# EAGLE schematic all_scheme (EAGLE 9.6.2)
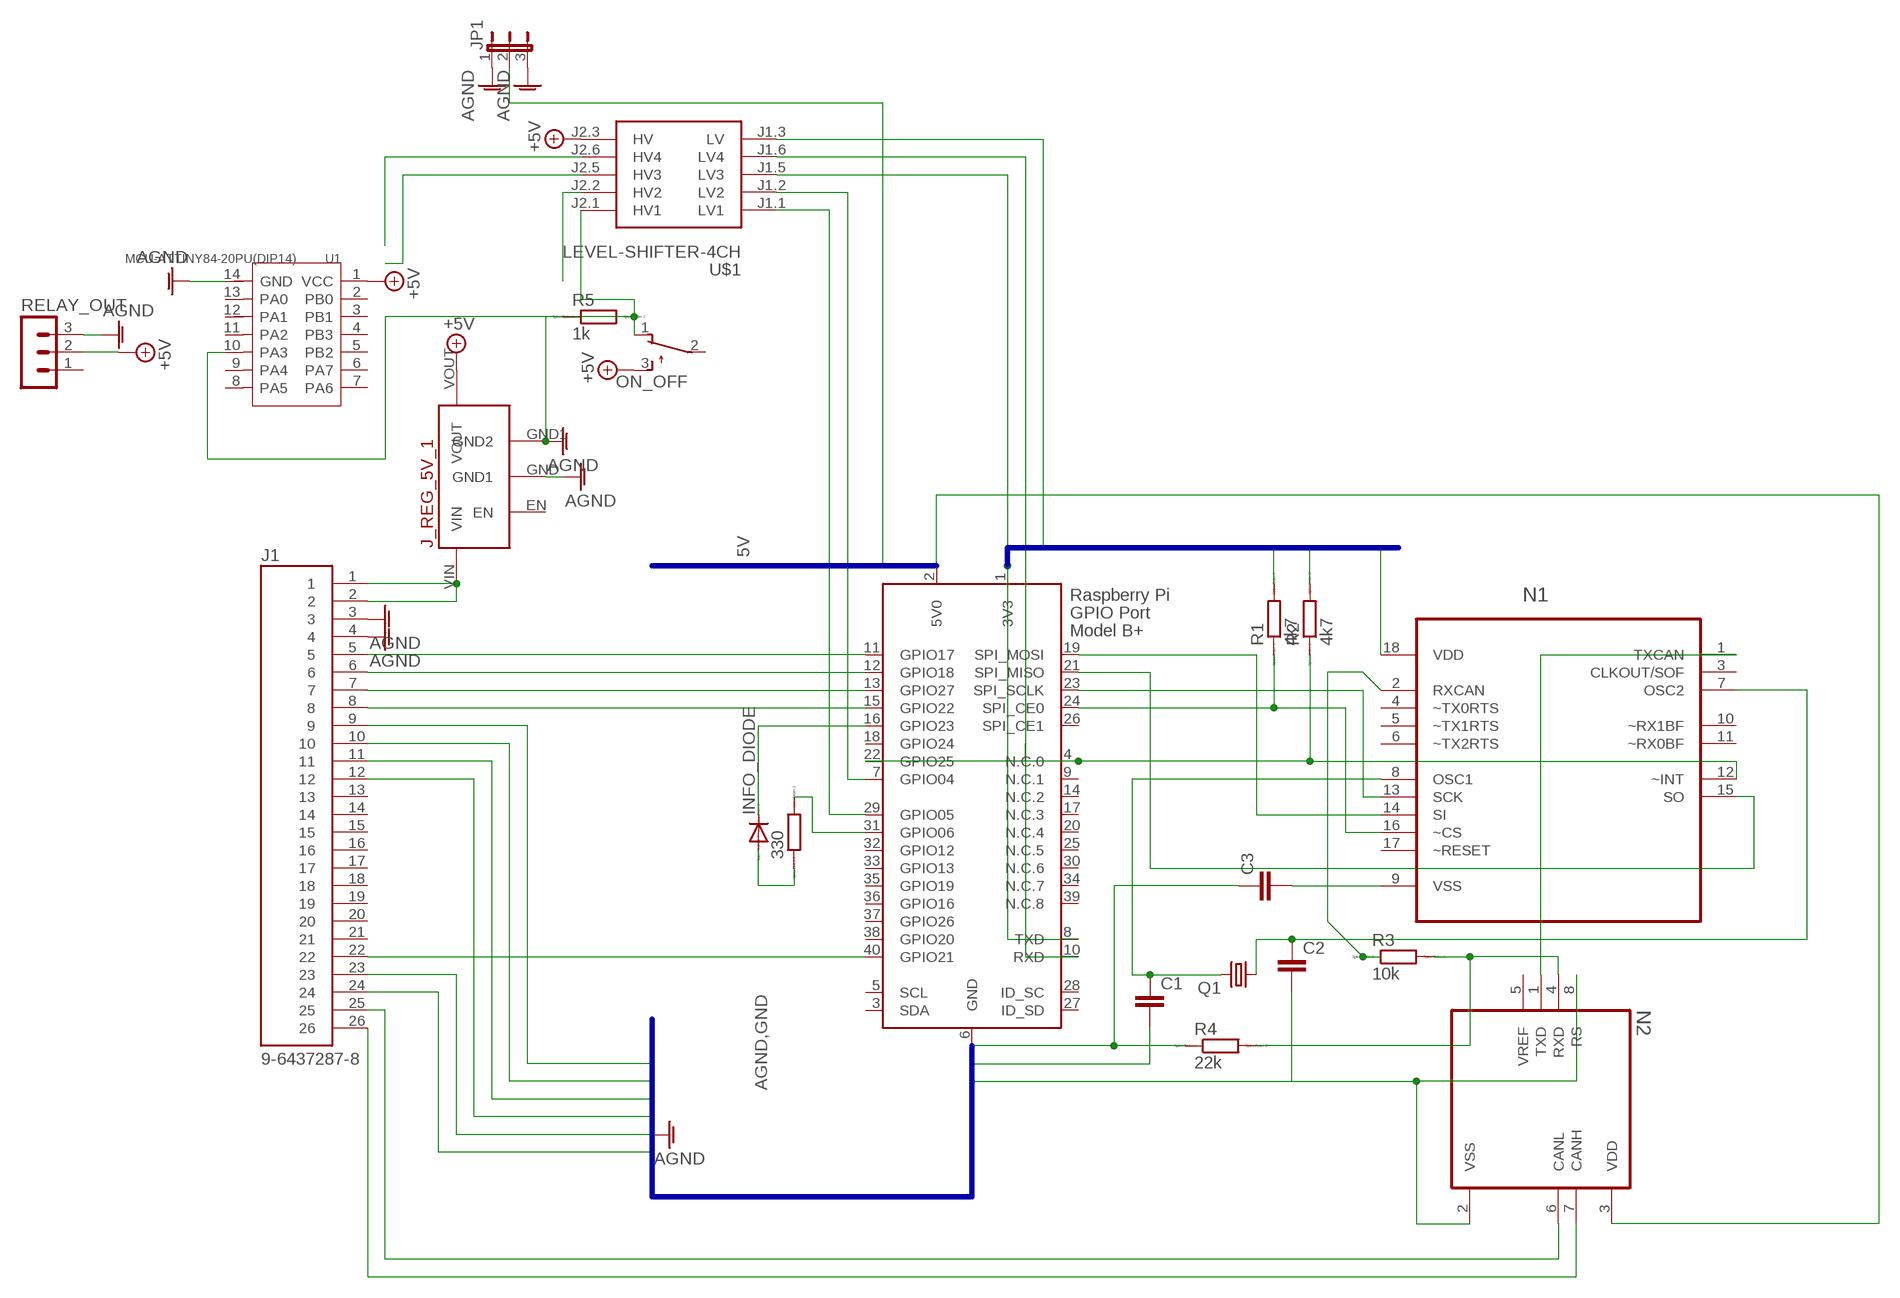
[diagram p0: schematic, sheet 1]

## Parts
330  R0207/10  [0207/10]
C1  C5/2.5  [C5B2.5]
C2  C5/2.5  [C5B2.5]
C3  C5/2.5  [C5B2.5]
INFO_DIODE  1N4004  [DO41-10]
J1  9-6437287-8  [TE_9-6437287-8]
J_REG_5V_1  5V_VOLTAGE_REGULATOR  [5V_VOLTAGE_REGULATOR]
JP1  JP2E  [JP2]
N1  MCP2515-E/P  [DIP254P762X432-18]
N2  MCP2551-E/P  [DIP787W46P254L927H533Q8]
ON_OFF  TL32PO  [TL3XPO]
Q1  CRYSTALHC49S  [HC49/S]
R1  4k7  R0207/10  [0207/10]
R2  4k7  R0207/10  [0207/10]
R3  10k  R0207/10  [0207/10]
R4  22k  R0207/10  [0207/10]
R5  1k  R0204/7  [0204/7]
RELAY_OUT  MA03-1  [MA03-1]
U1  MCU-ATTINY84-20PU(DIP14)  [DIP14-2.54-17.24X6.35MM]
U$1  LEVEL-SHIFTER-4CH  [LEVEL-SHIFTER-4CH]
X1  RASPI_GPIO_B+_PIN  [RASPI_GPIO_B+_PIN]

## Nets
4K: N1.14(SI) X1.19(SPI_MOSI)
5V: JP1.2 N2.3(VDD) X1.2(5V0)
+5V: J_REG_5V_1.VOUT ON_OFF.3(S) RELAY_OUT.2 U1.1(VCC) U$1.J2.3(HV)
AGND: J1.3 J1.4 J1.23 J_REG_5V_1.GND1(GND2) J_REG_5V_1.GND(GND1) JP1.1 JP1.3 R5.1 RELAY_OUT.3 U1.14(GND)
B$1: N1.18(VDD) R1.2 R2.2 U$1.J1.3(LV)
GND: C1.2 C2.2 C3.1 J1.9 J1.10 J1.11 J1.12 J1.24 N2.2(VSS) N2.8(RS) R4.1 X1.6(GND)
N$1: J1.26 N2.7(CANH)
N$2: J1.25 N2.6(CANL)
N$3: J1.1 J1.2 J_REG_5V_1.VIN
N$4: N1.13(SCK) X1.23(SPI_SCLK)
N$5: N2.4(RXD) R3.2 R4.2
N$6: N1.15(SO) X1.21(SPI_MISO)
N$7: N1.16(~CS) R1.1 X1.24(SPI_CE0)
N$8: N1.1(TXCAN) N2.1(TXD)
N$9: C1.1 N1.8(OSC1) Q1.2
N$10: N1.2(RXCAN) R3.1
N$11: C2.1 N1.7(OSC2) Q1.1
N$12: C3.2 N1.9(VSS)
N$13: N1.12(~INT) R2.1 X1.4(N.C.0) X1.22(GPIO25)
N$14: J1.5 X1.11(GPIO17)
N$15: J1.6 X1.12(GPIO18)
N$16: J1.7 X1.13(GPIO27)
N$17: J1.8 X1.15(GPIO22)
N$18: J1.22 X1.40(GPIO21)
N$19: 330.1 INFO_DIODE.A
N$20: 330.2 X1.31(GPIO06)
N$21: INFO_DIODE.C X1.16(GPIO23)
N$22: U$1.J2.6(HV4)
N$24: ON_OFF.1(O) R5.2 U1.10(PA3) U$1.J2.1(HV1)
N$25: U$1.J2.5(HV3)
N$26: U$1.J1.6(LV4) X1.10(RXD)
N$27: U$1.J1.5(LV3) X1.1(3V3) X1.8(TXD)
N$29: U$1.J2.2(HV2)
N$30: U$1.J1.1(LV1) X1.29(GPIO05)
N$31: U$1.J1.2(LV2) X1.7(GPIO04)
Unconnected: J1.13 J1.14 J1.15 J1.16 J1.17 J1.18 J1.19 J1.20 J1.21 J_REG_5V_1.EN N1.3(CLKOUT/SOF) N1.4(~TX0RTS) N1.5(~TX1RTS) N1.6(~TX2RTS) N1.10(~RX1BF) N1.11(~RX0BF) N1.17(~RESET) N2.5(VREF) ON_OFF.2(P) RELAY_OUT.1 U1.2(PB0) U1.3(PB1) U1.4(PB3) U1.5(PB2) U1.6(PA7) U1.7(PA6) U1.8(PA5) U1.9(PA4) U1.11(PA2) U1.12(PA1) U1.13(PA0) X1.3(SDA) X1.5(SCL) X1.9(N.C.1) X1.14(N.C.2) X1.17(N.C.3) X1.18(GPIO24) X1.20(N.C.4) X1.25(N.C.5) X1.26(SPI_CE1) X1.27(ID_SD) X1.28(ID_SC) X1.30(N.C.6) X1.32(GPIO12) X1.33(GPIO13) X1.34(N.C.7) X1.35(GPIO19) X1.36(GPIO16) X1.37(GPIO26) X1.38(GPIO20) X1.39(N.C.8)

## Buses
5V
AGND,GND
B$1

## Library data of the parts
330 R1-R5 = eagle-ltspice:R: RESISTOR, European symbol; SPICEMODEL: NONE; SPICEPREFIX: R
C1-C3 = capacitor-wima:C: CAPACITOR naming: grid - package width
INFO_DIODE = diode:1N4004: DIODE general purpose rectifier, 1 A
J1 = 9-6437287-8:9-6437287-8: Conn Wire to Board RCP 26 POS 3mm Solder RA Thru-Hole Tube Check prices <https://pricing.snapeda.com/parts/9-6437287-8/TE%20Connectivity/view-part?ref=eda>; AVAILABILITY: Warning; COMMENT: 9-6437287-8; DESCRIPTION: SUPER SEAL Series; 26 Way Through Hole Plug Header; with Solder Termination; EU_ROHS_COMPLIANCE: Compliant; MF: TE Connectivity; MP: 9-6437287-8; PACKAGE: None; PRICE: None; PURCHASE-URL: https://pricing.snapeda.com/search/part/9-6437287-8/?ref=eda
J_REG_5V_1 = Pololu Voltage Regulators:5V_VOLTAGE_REGULATOR: Polulu 5V Step-Up/Step-Down Voltage REgulator S7V7F5
JP1 = jumper:JP2E: JUMPER
N1 = MCP2515-E_P:MCP2515-E/P: Stand-Alone CAN Controller Check prices <https://pricing.snapeda.com/parts/MCP2515-E/P/Microchip%20Technology/view-part?ref=eda>; AVAILABILITY: Warning; DESCRIPTION: CANbus Controller CAN 2.0 SPI Interface 18-PDIP; MF: Microchip Technology; MP: MCP2515-E/P; PACKAGE: DIP-18 Microchip; PRICE: None; PURCHASE-URL: https://pricing.snapeda.com/search/part/MCP2515-E/P/?ref=eda
N2 = MCP2551-E_P:MCP2551-E/P: Check prices <https://pricing.snapeda.com/parts/MCP2551-E/P/Microchip/view-part?ref=eda>; AVAILABILITY: Warning; DESCRIPTION: 1/1 Transceiver Half CANbus 8-PDIP; MF: Microchip; MP: MCP2551-E/P; PACKAGE: DIP-8 Microchip; PRICE: None; PURCHASE-URL: https://pricing.snapeda.com/search/part/MCP2551-E/P/?ref=eda
ON_OFF = switch:TL32PO: TINY SWITCH ON - MOM Source: http://www2.produktinfo.conrad.com/datenblaetter/700000-724999/705152-da-01-de-Subminiaturschalter_TL_36YO.pdf
Q1 = crystal:CRYSTAL: CRYSTAL; OC_FARNELL: 1667008; OC_NEWARK: unknown
RELAY_OUT = con-lstb:MA03-1: PIN HEADER; OC_FARNELL: unknown; OC_NEWARK: unknown
U1 = MCU-ATTINY84-20PU_DIP14_:MCU-ATTINY84-20PU(DIP14): 310010126 Check prices <https://pricing.snapeda.com/parts/ATTINY84-20PU/Microchip/view-part?ref=eda>; AVAILABILITY: Warning; DESCRIPTION: AVR AVR® ATtiny Microcontroller IC 8-Bit 20MHz 8KB (4K x 16) FLASH 14-PDIP; MF: Microchip; MP: ATTINY84-20PU; PACKAGE: DIP-14 Microchip; PRICE: None
U$1 = diy-modules:LEVEL-SHIFTER-4CH: 4-Channel Bi-Directional Logic Level Converter based on BSS128 transistors Click here to find device on ebay.com <http://www.ebay.com/sch/i2c+logic+converter+module>
X1 = raspberrypi_bastelstube_v13:RASPI_GPIO_B+: Only the 2x20 header connector, nothing else